# Altium schematic sheet Motor Drivers.SchDoc
size A3; Address1: ECE Department; Address2: University of Canterbury; Address3: Christchurch 8041; Address4: New Zealand; Revision: 1
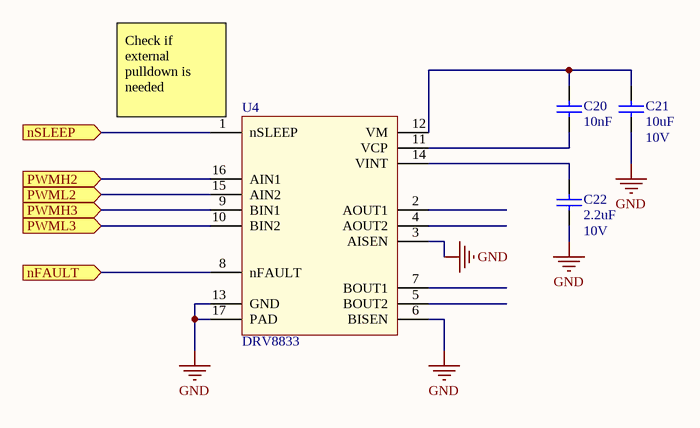
[diagram p0: Motor Drivers.SchDoc]

## Parts
C20  10nF  [CAPC1608L]
C21  Max Voltage: 10V  [CAPC2012L]  (hidden comment: 10uF)
C22  Max Voltage: 10V  [CAPC1608L]  (hidden comment: 2.2uF)
U4  DRV8833  [HTSOP16]

## Ports
nFAULT (in), nSLEEP (in), PWMH2 (in), PWMH3 (in), PWML2 (in), PWML3 (in)

## Nets
GND: C21.1 C22.1 U4.3(AISEN) U4.6(BISEN) U4.13(GND) U4.17(PAD)
nFAULT: U4.8(nFAULT) ; port nFAULT
nSLEEP: U4.1(nSLEEP) ; port nSLEEP
PWMH2: U4.16(AIN1) ; port PWMH2
PWMH3: U4.9(BIN1) ; port PWMH3
PWML2: U4.15(AIN2) ; port PWML2
PWML3: U4.10(BIN2) ; port PWML3
NetC20_1: C20.1 U4.11(VCP)
NetC20_2: C20.2 C21.2 U4.12(VM)
NetC22_2: C22.2 U4.14(VINT)

Not connected (* = marked no-connect by the designer): U4 2(AOUT1) 4(AOUT2) 5(BOUT2) 7(BOUT1)

## Notes on the sheet
- (near U4) Check if external pulldown is needed
- Title
- Drawn by:
- Date:
- Time:
- Revision:
- Sheet
- of
- File:

## Library data of the parts
C20 = CC_10nF_0603: CAP CER 10nF X7R +-10% 50V 0603; PackageReference: 0603; Code_IPC: 1608 [0603]; Verify: *; Supplier: ECE Dept; Storage Location: PCB Assembly WS; Value: 10nF
C21 = CC_10uF_0805_10V: CAP CER 10uF X7R +-20% 10V 0805; Note: Footprint corresponds to dimensions for bulk cassette packaging. This case size has tightened tolerances.; PackageReference: 0805; Code_IPC: 2012[0805]; Verify: *; Supplier: ECE Dept; Storage Location: PCB Assembly WS; Value: 10uF
C22 = CC_2.2uF_0603: CAP CER 2.2uF X5R +-20% 10V 0603; PackageReference: 0603; Code_IPC: 1608 [0603]; Verify: *; Supplier: ECE Dept; Storage Location: PCB Assembly WS; Value: 2.2uF
U4 = DRV8833: Dual H-Bridge Motor Driver 1.5A